# Altium schematic sheet health-sensor-usb.SchDoc
size A4
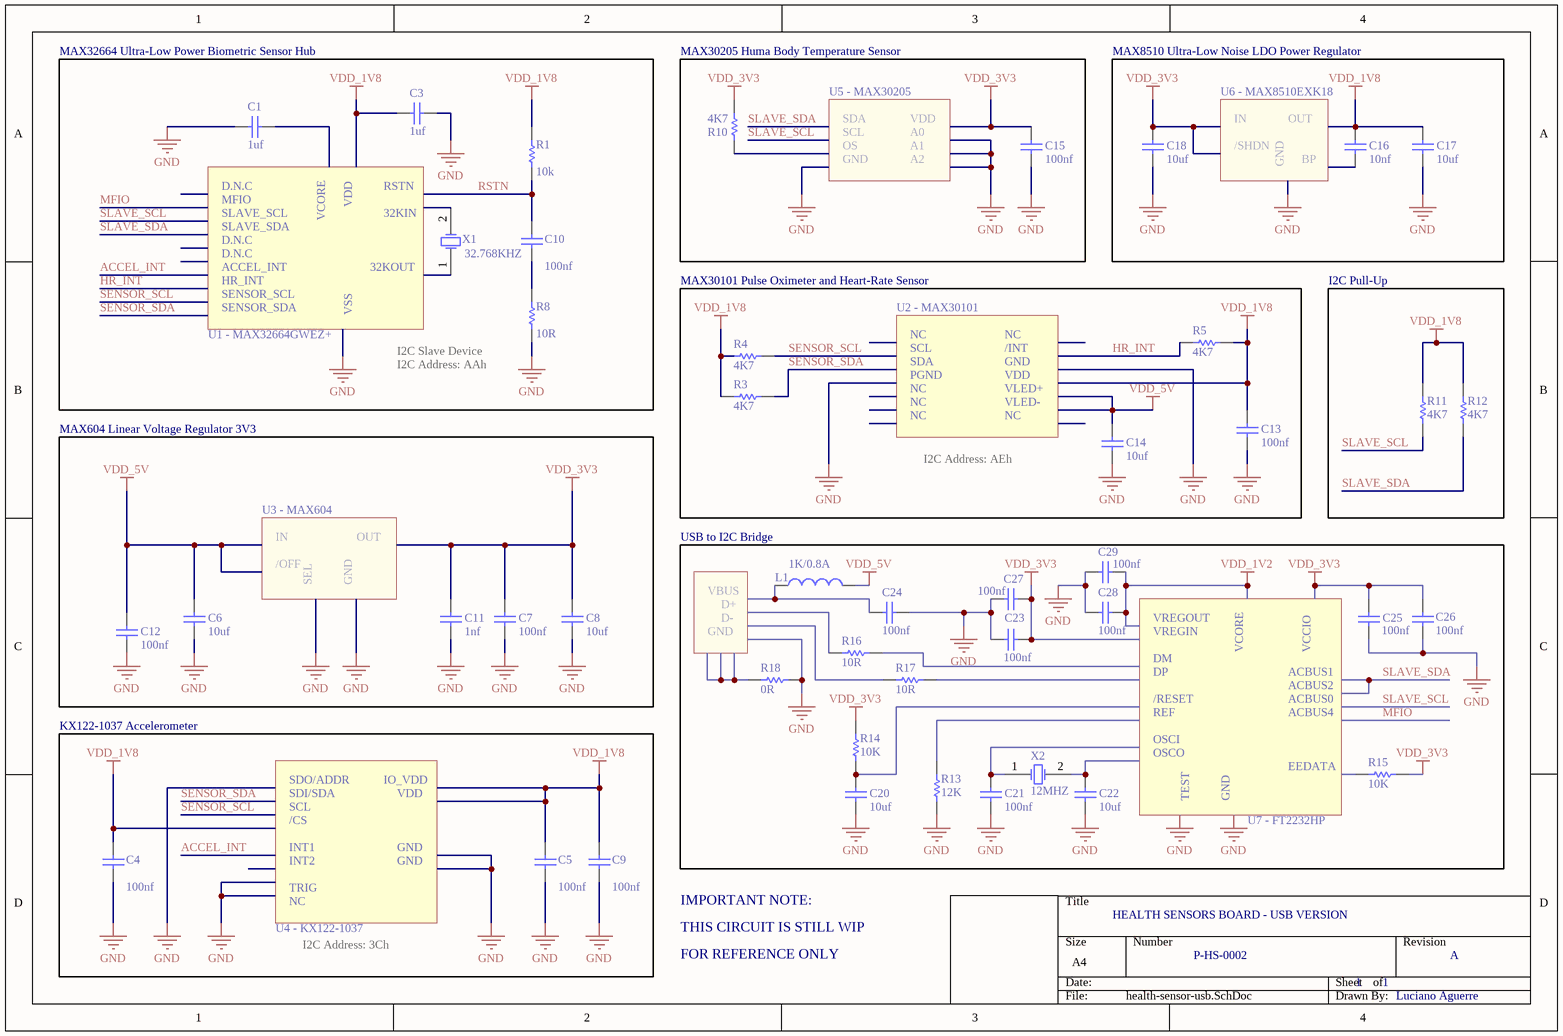
[diagram p0: health-sensor-usb.SchDoc]

## Parts
C1  value 1uf  [RAD-0.3]  (hidden comment: Cap)
C3  value 1uf  [RAD-0.3]  (hidden comment: Cap)
C4  value 100nf  [RAD-0.3]  (hidden comment: Cap)
C5  value 100nf  [RAD-0.3]  (hidden comment: Cap)
C6  value 10uf  [RAD-0.3]  (hidden comment: Cap)
C7  value 100nf  [RAD-0.3]  (hidden comment: Cap)
C8  value 10uf  [RAD-0.3]  (hidden comment: Cap)
C9  value 100nf  [RAD-0.3]  (hidden comment: Cap)
C10  value 100nf  [RAD-0.3]  (hidden comment: Cap)
C11  value 1nf  [RAD-0.3]  (hidden comment: Cap)
C12  value 100nf  [RAD-0.3]  (hidden comment: Cap)
C13  value 100nf  [RAD-0.3]  (hidden comment: Cap)
C14  value 10uf  [RAD-0.3]  (hidden comment: Cap)
C15  value 100nf  [RAD-0.3]  (hidden comment: Cap)
C16  value 10nf  [RAD-0.3]  (hidden comment: Cap)
C17  value 10uf  [RAD-0.3]  (hidden comment: Cap)
C18  value 10uf  [RAD-0.3]  (hidden comment: Cap)
C20  value 10uf  [RAD-0.3]  (hidden comment: Cap)
C21  value 100nf  [RAD-0.3]  (hidden comment: Cap)
C22  value 10uf  [RAD-0.3]  (hidden comment: Cap)
C23  value 100nf  [RAD-0.3]  (hidden comment: Cap)
C24  value 100nf  [RAD-0.3]  (hidden comment: Cap)
C25  value 100nf  [RAD-0.3]  (hidden comment: Cap)
C26  value 100nf  [RAD-0.3]  (hidden comment: Cap)
C27  value 100nf  [RAD-0.3]  (hidden comment: Cap)
C28  value 100nf  [RAD-0.3]  (hidden comment: Cap)
C29  value 100nf  [RAD-0.3]  (hidden comment: Cap)
L1  1K/0.8A  [0402-A]
R1  value 10k  [AXIAL-0.3]  (hidden comment: Res1)
R3  value 4K7  [AXIAL-0.3]  (hidden comment: Res1)
R4  value 4K7  [AXIAL-0.3]  (hidden comment: Res1)
R5  value 4K7  [AXIAL-0.3]  (hidden comment: Res1)
R8  value 10R  [AXIAL-0.3]  (hidden comment: Res1)
R10  value 4K7  [AXIAL-0.3]  (hidden comment: Res1)
R11  value 4K7  [AXIAL-0.3]  (hidden comment: Res1)
R12  value 4K7  [AXIAL-0.3]  (hidden comment: Res1)
R13  value 12K  [AXIAL-0.3]  (hidden comment: Res1)
R14  value 10K  [AXIAL-0.3]  (hidden comment: Res1)
R15  value 10K  [AXIAL-0.3]  (hidden comment: Res1)
R16  value 10R  [AXIAL-0.3]  (hidden comment: Res1)
R17  value 10R  [AXIAL-0.3]  (hidden comment: Res1)
R18  value 0R  [AXIAL-0.3]  (hidden comment: Res1)
X1  32.768KHZ  [R38]
X2  12MHZ  [R38]

## Blocks framed on the sheet
I2C Pull-Up: R11 R12

## Nets
GND: C1.2 C3.1 C4.1 C5.1 C6.1 C7.1 C8.1 C9.1 C11.1 C12.1 C13.1 C14.1 C15.1 C17.1 C18.1 C20.1 C21.1 C22.1 C23.2 C24.1 C25.2 C26.2 C27.2 C28.2 C29.2 R8.1 R13.2 R18.1
VDD_1V2: C28.1 C29.1
VDD_1V8: C3.2 C4.2 C5.2 C9.2 C13.2 C16.2 C17.2 R1.2 R3.2 R4.2 R5.1 R11.1 R12.1
VDD_3V3: C7.2 C8.2 C11.2 C15.2 C18.2 C23.1 C25.1 C26.1 C27.1 R10.2 R14.2 R15.2
VDD_5V: C6.2 C12.2 C14.2 L1.2
HR_INT: R5.2
RSTN: C10.2 R1.1
SENSOR_SCL: R4.1
SENSOR_SDA: R3.1
SLAVE_SCL: R11.2
SLAVE_SDA: R12.2
NetC10_1: C10.1 R8.2
NetC20_2: C20.2 R14.1
NetC21_2: C21.2 X2.1(OSC1)
NetC22_2: C22.2 X2.2(OSC2)
NetC24_2: C24.2 L1.1

Not connected (* = marked no-connect by the designer): C1 1; C16 1; R10 1; R13 1; R15 1; R16 1 2; R17 1 2; R18 2; X1 1(OSC1) 2(OSC2)

## Notes on the sheet
- MAX32664 Ultra-Low Power Biometric Sensor Hub
- MAX30205 Huma Body Temperature Sensor
- U5 - MAX30205
- MAX8510 Ultra-Low Noise LDO Power Regulator
- U6 - MAX8510EXK18
- SDA
- SCL
- OS
- GND
- VDD
- A0
- A1
- A2
- IN
- /SHDN
- (near C16) OUT
- (near C16) BP
- D.N.C
- MFIO
- SLAVE_SCL
- SLAVE_SDA
- VCORE
- RSTN
- (near X1) 32KIN
- ACCEL_INT
- HR_INT
- SENSOR_SCL
- SENSOR_SDA
- VSS
- (near X1) 32KOUT
- MAX30101 Pulse Oximeter and Heart-Rate Sensor
- U2 - MAX30101
- U1 - MAX32664GWEZ+
- NC
- PGND
- /INT
- MAX604 Linear Voltage Regulator 3V3
- (near R8) I2C Slave Device
  I2C Address: AAh
- VLED+
- VLED-
- U3 - MAX604
- I2C Address: AEh
- /OFF
- SEL
- OUT
- (near L1) USB to I2C Bridge
- VBUS
- D+
- D-
- VREGIN
- VREGOUT
- VCCIO
- DM
- DP
- /RESET
- REF
- ACBUS1
- ACBUS2
- ACBUS0
- ACBUS4
- KX122-1037 Accelerometer
- SDO/ADDR
- IO_VDD
- OSCO
- OSCI
- (near R15) EEDATA
- SDI/SDA
- /CS
- INT1
- TEST
- U7 - FT2232HP
- INT2
- TRIG
- IMPORTANT NOTE:
- HEALTH SENSORS BOARD - USB VERSION
- U4 - KX122-1037
- I2C Address: 3Ch
- THIS CIRCUIT IS STILL WIP
- FOR REFERENCE ONLY
- P-HS-0002
- 1
- A
- Luciano Aguerre
- Labels drawn without touching a wire or pin: GND

## Library data of the parts
C1 C3-C18 C20-C29 = Cap: Capacitor; Published: 8-Jun-2000; LatestRevisionDate: 17-Jul-2002; LatestRevisionNote: Re-released for DXP Platform.; PackageReference: RAD-0.3; Publisher: Altium Limited; PackageDescription: Radial Cap, Thru-Hole; 2 Leads; 0.3 in Pin Spacing
L1 = Inductor: Code_IEC: 1005; Published: 8-Jun-2000; LatestRevisionDate: 29-May-2009; LatestRevisionNote: IPC-7351 Footprint Added.; PackageReference: 0402-A; Publisher: Altium Limited; PackageDescription: Chip Inductor; Code_JEITA: 0402; Value: 1K/0.8A
R1 R3-R5 R8 R10-R18 = Res1: Resistor; Published: 8-Jun-2000; LatestRevisionDate: 17-Jul-2002; LatestRevisionNote: Re-released for DXP Platform.; PackageReference: AXIAL-0.3; Publisher: Altium Limited; PackageDescription: Axial Device, Thru-Hole; 2 Leads; 0.3 in Pin Spacing
X1 X2 = XTAL: Crystal Oscillator; Published: 8-Jun-2000; LatestRevisionDate: 17-Jul-2002; LatestRevisionNote: Re-released for DXP Platform.; PackageReference: R38; Publisher: Altium Limited; PackageDescription: Crystal, Thru-Hole; 2 Leads; Body 3.1 x 8.2 mm (Dia.xH)